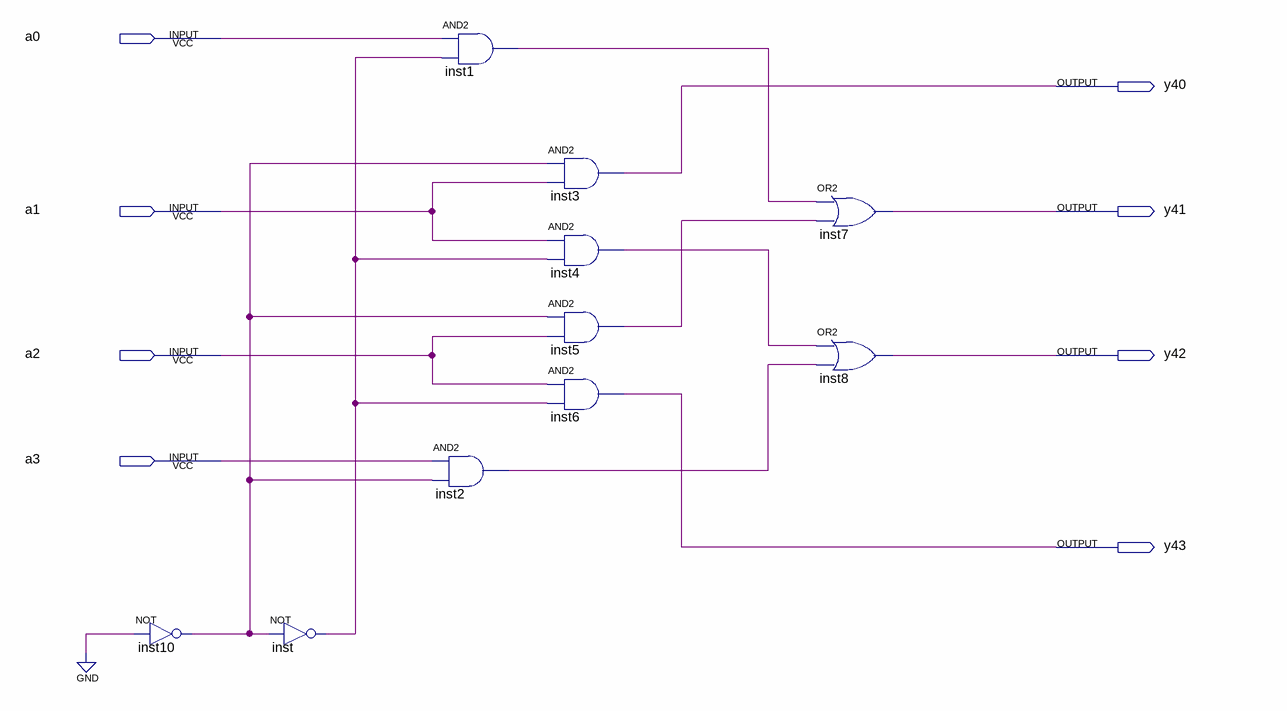
[diagram p0: schematic sheet]
// Quartus schematic right.bdf as structural Verilog: 10 symbols, 8 pins
module right (
  input  a0,
  input  a1,
  input  a2,
  input  a3,
  output y40,
  output y41,
  output y42,
  output y43
);

  wire inst1_out, inst2_out, inst4_out, inst5_out, inst10_out, inst_out;

  not inst10 (inst10_out, 1'b0);
  not inst (inst_out, inst10_out);
  and inst1 (inst1_out, a0, inst_out);
  and inst2 (inst2_out, a3, inst10_out);
  and inst3 (y40, inst10_out, a1);
  and inst4 (inst4_out, a1, inst_out);
  and inst5 (inst5_out, inst10_out, a2);
  and inst6 (y43, a2, inst_out);
  or inst7 (y41, inst1_out, inst5_out);
  or inst8 (y42, inst4_out, inst2_out);
endmodule
